# EAGLE design cartridge (EAGLE 9.6.2)
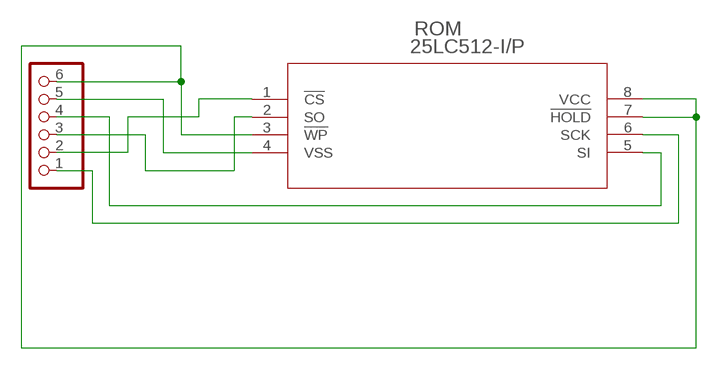
[diagram p0: schematic, sheet 1]

## Parts
ROM  25LC512-I/P  [PDIP8_300MC_MCH]
SPI  PINHD-1X6  [1X06]

## Nets
N$1: ROM.3(!WP) ROM.7(!HOLD) ROM.8(VCC) SPI.6
N$2: ROM.5(SI) SPI.4
N$3: ROM.4(VSS) SPI.5
N$4: ROM.6(SCK) SPI.1
N$5: ROM.1(!CS) SPI.2
N$6: ROM.2(SO) SPI.3

## Library data of the parts
ROM = 25LC512:25LC512-I/P; BUILT_BY: EMA_UL_Team; MANUFACTURER_PART_NUMBER: 25LC512-I/P; SOURCELIBRARY: Microchip_2011-05-13; VENDOR: Microchip
SPI = pinhead:PINHD-1X6: PIN HEADER

## Board
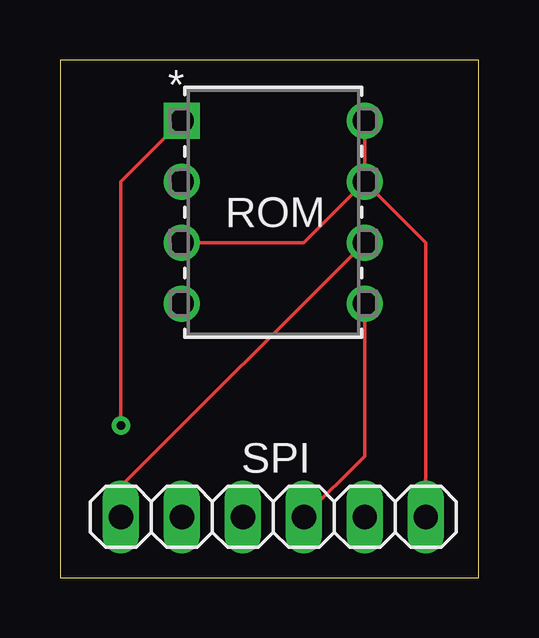
[diagram p1: board, top side]
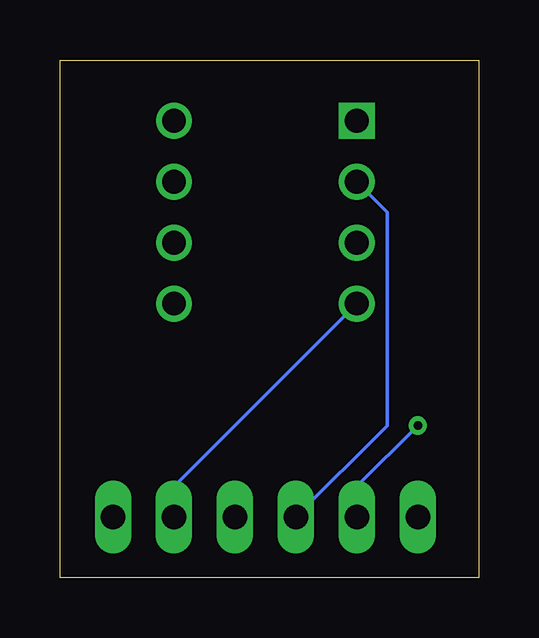
[diagram p2: board, bottom side, seen from below]

Size 17.45 x 21.58 mm. Coordinates in mm from the lower left corner, seen from the top.
Outline: 0,0 17.45,0 17.45,21.58 0,21.58 0,0
Copper layers (1*16): Top 0.035mm / dielectric 1.5mm / Bottom 0.035mm
Design rules "default": minimum track width 6mil, minimum drill 0.35mm, track to track 6mil, track to pad 6mil, pad to pad 6mil, via to via 6mil, smd to smd 6mil, copper to edge 40mil, drill to drill 6mil, minimum pad ring 10mil, minimum via ring 8mil, stop-mask expansion 4mil, vias tented up to drill 0mil, thermal gap 10mil

### Footprints (pad centres in the part's own frame; a part is rotated, then mirrored left to right if it is on the bottom)
PDIP8_300MC_MCH = drill 0.991 pad 1.499 square: 1 0,0 | drill 0.991 pad 1.499: 2 0,-2.54; 3 0,-5.08; 4 0,-7.62; 5 7.62,-7.62; 6 7.62,-5.08; 7 7.62,-2.54; 8 7.62,0
1X06 = drill 1.016 long: 1 -6.35,0; 2 -3.81,0; 3 -1.27,0; 4 1.27,0; 5 3.81,0; 6 6.35,0

### Placement (x,y rotation side)
ROM  5.08,19.05 0 top
SPI  8.89,2.54 0 top

### Tracks (layer width: path | path; a pad name or v marks a point on that pad's centre or on a via)
N$1
  Top 0.152: ROM.8 ROM.7 | ROM.7 10.16,13.97 ROM.3 | ROM.7 15.24,13.97 SPI.6
N$2
  Top 0.152: ROM.5 12.7,5.08 SPI.4
N$3
  Bottom 0.152: ROM.4 12.7,3.81 SPI.5
N$4
  Top 0.152: ROM.6 2.54,3.81 SPI.1
N$5  (via drill 0.35)
  Top 0.152: ROM.1 2.54,16.51 v2.54,6.35
  Bottom 0.152: v2.54,6.35 5.08,3.81 SPI.2
N$6
  Bottom 0.152: ROM.2 3.81,15.24 3.81,6.35 SPI.3